# Altium schematic sheet Farmbot_Rpi_ext.schdoc
size 309 x 223 mm; Symbol: Sheet-Symbol_A4; Device: Sheet-Symbol_A4; Company: EasyEDA.com; Drawed: EasyEDA Pro; Reviewed: EasyEDA Pro; Version: V0.1; Page Size: A4; @Project Name: RPI-EXT; @Page Count: 1; @Update Date: 2022-12-10; @Create Date: 2022-12-01; @Schematic Name: Schematic1_1; Part Number: JLCPCB-002; @Page No: 1; @Page Name: Farmbot_Rpi_ext
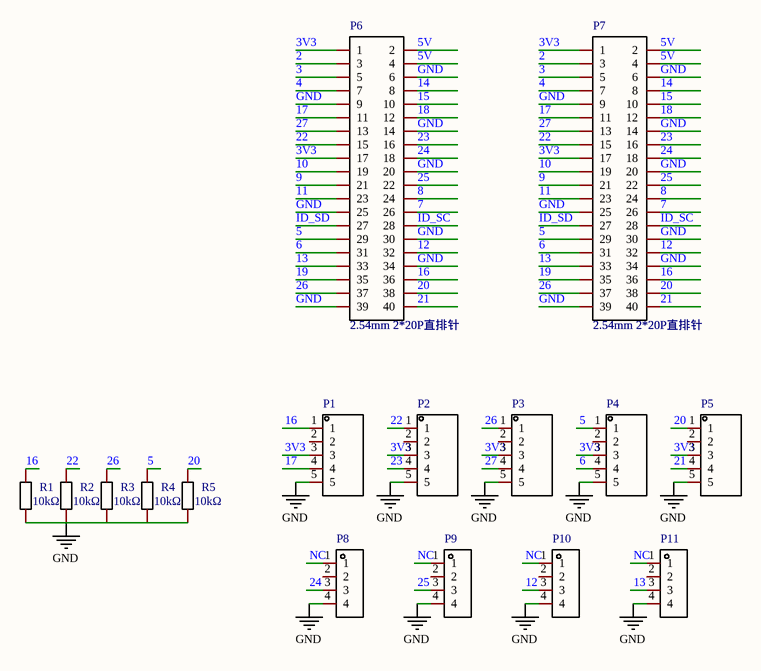
[diagram p0: Farmbot_Rpi_ext.schdoc]

## Parts
P1  77311-462K05LF  [HDR-TH_5P-P2.54-V-M]  (value not drawn)
P2  77311-462K05LF  [HDR-TH_5P-P2.54-V-M]  (value not drawn)
P3  77311-462K05LF  [HDR-TH_5P-P2.54-V-M]  (value not drawn)
P4  77311-462K05LF  [HDR-TH_5P-P2.54-V-M]  (value not drawn)
P5  77311-462K05LF  [HDR-TH_5P-P2.54-V-M]  (value not drawn)
P6  2.54mm 2*20P直排针  [HDR-TH_40P-P2.54-V-M-R2-C20-S2.54]
P7  2.54mm 2*20P直排针  [HDR-TH_40P-P2.54-V-M-R2-C20-S2.54]
P8  HDR2.54-LI-2x4P  [HDR-TH_4P-P2.54-V-M]  (value not drawn)
P9  HDR2.54-LI-2x4P  [HDR-TH_4P-P2.54-V-M]  (value not drawn)
P10  HDR2.54-LI-2x4P  [HDR-TH_4P-P2.54-V-M]  (value not drawn)
P11  HDR2.54-LI-2x4P  [HDR-TH_4P-P2.54-V-M]  (value not drawn)
R1  10kΩ  [R0603]
R2  10kΩ  [R0603]
R3  10kΩ  [R0603]
R4  10kΩ  [R0603]
R5  10kΩ  [R0603]

## Nets
GND: P1.5 P2.5 P3.5 P4.5 P5.5 P6.6 P6.9 P6.14 P6.20 P6.25 P6.30 P6.34 P6.39 P7.6 P7.9 P7.14 P7.20 P7.25 P7.30 P7.34 P7.39 P8.4 P9.4 P10.4 P11.4 R1.1 R2.1 R3.1 R4.1 R5.1
2: P6.3 P7.3
3: P6.5 P7.5
3V3: P1.3 P2.3 P3.3 P4.3 P5.3 P6.1 P6.17 P7.1 P7.17
4: P6.7 P7.7
5: P4.1 P6.29 P7.29 R4.2
5V: P6.2 P6.4 P7.2 P7.4
6: P4.4 P6.31 P7.31
7: P6.26 P7.26
8: P6.24 P7.24
9: P6.21 P7.21
10: P6.19 P7.19
11: P6.23 P7.23
12: P6.32 P7.32 P10.3
13: P6.33 P7.33 P11.3
14: P6.8 P7.8
15: P6.10 P7.10
16: P1.1 P6.36 P7.36 R1.2
17: P1.4 P6.11 P7.11
18: P6.12 P7.12
19: P6.35 P7.35
20: P5.1 P6.38 P7.38 R5.2
21: P5.4 P6.40 P7.40
22: P2.1 P6.15 P7.15 R2.2
23: P2.4 P6.16 P7.16
24: P6.18 P7.18 P8.3
25: P6.22 P7.22 P9.3
26: P3.1 P6.37 P7.37 R3.2
27: P3.4 P6.13 P7.13
ID_SC: P6.28 P7.28
ID_SD: P6.27 P7.27
NC: P8.1 P9.1 P10.1 P11.1

Not connected (* = marked no-connect by the designer): P1 2; P2 2; P3 2; P4 2; P5 2; P8 2; P9 2; P10 2; P11 2

## Notes on the sheet
- 1
- 2
- 3
- 4
- 5
- 6
- A
- B
- C
- Schematic
- Schematic1_1
- Create Date
- Update Date
- 2022-12-10
- 2022-12-01
- Reviewed
- Drawed
- Page
- EasyEDA Pro
- Farmbot_Rpi_ext
- Part Number
- RPI-EXT
- JLCPCB-002
- D
- VER
- SIZE
- PAGE
- OF
- V0.1
- A4
- EasyEDA.com

## Library data of the parts
P1-P5 = 77311-462K05LF: Pitch:2.54mm Number of Pins:- Number of Rows: Pin Structure:- Row Spacing:- Mounting Type:Straight Circluar Pins/Square Pins:Square Pins Current Rating (Max):- Voltage Rating (Max):- Length of Mating Pin:- Insulation Height:2.54mm Length of End Connection; Manufacturer: Amphenol; Add into BOM: yes; Pitch: 2.54mm; Name: 77311-462K05LF; Symbol: 77311-462K05LF; Device: 77311-462K05LF; LCSC Part Name: 2.54mm 直插 方针 单排针，价格为单根针; Supplier Part: C180219; Manufacturer Part: 77311-462K05LF; Supplier Footprint: 直插,P=2.54mm; Datasheet: https://atta.szlcsc.com/upload/public/pdf/source/20180316/8D6DA4565B5F973B8A623FDF4201467C.pdf; Supplier: LCSC; Convert to PCB: yes; Number of Pins: -; Pin Structure: -; Row Spacing: -; Mounting Type: Straight; Circluar Pins/Square Pins: Square Pins; Current Rating (Max): -; Voltage Rating (Max): -; Length of Mating Pin: -; Insulation Height: 2.54mm; Length of End Connection Pin: -; Contact Plating: -; Operating Temperature Range: -; Welding Temperature (Max): -; Color: Black
P6 P7 = 2.54mm 2*20P直排针: Pitch:2.54mm Number of Pins:40 Number of Rows:2 Pin Structure:2x20P Row Spacing:2.54mm Mounting Type:直插 Circluar Pins/Square Pins:方针 Current Rating (Max):3A Voltage Rating (Max):- Length of Mating Pin:6mm Insulation Height:- Length of End Connection Pin:3; Manufacturer: BOOMELE(博穆精密); Symbol: Header-Male-2.54_2x20; Add into BOM: yes; Pin Structure: 2x20P; Circluar Pins/Square Pins: 方针; Current Rating (Max): 3A; Name: 2.54mm 2*20P直排针; Device: 2.54mm 2*20P直排针; LCSC Part Name: 2.54mm 2x20P 直插 方针; Supplier Part: C50980; Manufacturer Part: 2.54mm 2*20P直排针; Supplier Footprint: 插件,P=2.54mm; JLCPCB Part Class: 扩展库; Datasheet: https://atta.szlcsc.com/upload/public/pdf/source/20151109/1457707571465.pdf; Supplier: LCSC; Convert to PCB: yes; Pitch: 2.54mm; Number of Pins: 40; Number of Rows: 2; Row Spacing: 2.54mm; Mounting Type: 直插; Voltage Rating (Max): -; Length of Mating Pin: 6mm; Insulation Height: -; Length of End Connection Pin: 3mm; Contact Material: 黄铜; Contact Plating: -; Operating Temperature Range: -40~+105; Color: 黑色
P8-P11 = HDR2.54-LI-2x4P: Add into BOM: yes; Name: HDR2.54-LI-2x4P; Symbol: HDR2.54-LI-2X4P; Device: HDR2.54-LI-2x4P; LCSC Part Name: HDR2.54-LI-2x4P; Supplier Part: C9900020145; Manufacturer Part: HDR2.54-LI-2x4P; Supplier Footprint: HDR-TH_4P-P2.54-V-M; Datasheet: https://atta.szlcsc.comnull; Supplier: LCSC; Convert to PCB: yes
R1-R5 = RMC060310K5%N: Resistance: Tolerance:±5% Tolerance:±5% Power(Watts):; Manufacturer: Tyohm(幸亚电阻); Add into BOM: yes; Tolerance: ±5%; Name: 10kΩ; Symbol: RMC060310K5%N; Device: RMC060310K5%N; LCSC Part Name: 10kΩ ±5% 100mW; Supplier Part: C269684; Manufacturer Part: RMC060310K5%N; Supplier Footprint: 0603; JLCPCB Part Class: 扩展库; Datasheet: https://atta.szlcsc.com/upload/public/pdf/source/20190115/C269684_8D87CA5E93509225B329A05891D1141E.pdf; Supplier: LCSC; Convert to PCB: yes; Value: 10kΩ